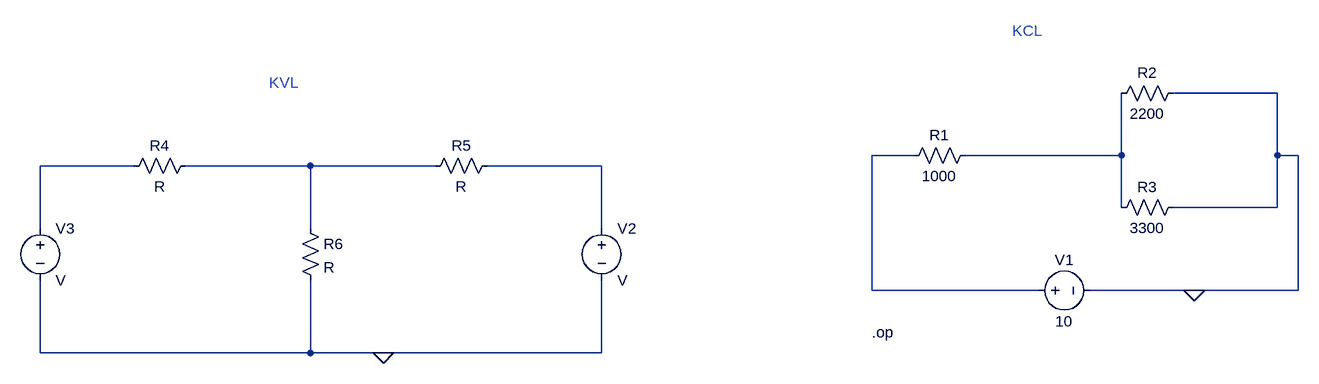
[diagram p0: schematic KCL  and KVL(1).asc]
KCL  and KVL(1).asc, the LTspice schematic file:
Version 4
SHEET 1 880 680
WIRE 624 48 464 48
WIRE 64 144 0 144
WIRE 384 144 384 48
WIRE 384 144 144 144
WIRE 624 144 624 48
WIRE 656 144 624 144
WIRE -1136 160 -1280 160
WIRE -864 160 -1056 160
WIRE -672 160 -864 160
WIRE -416 160 -592 160
WIRE 384 224 384 144
WIRE 624 224 624 144
WIRE 624 224 464 224
WIRE -1280 256 -1280 160
WIRE -864 256 -864 160
WIRE -416 256 -416 160
WIRE 0 352 0 144
WIRE 256 352 0 352
WIRE 496 352 336 352
WIRE 656 352 656 144
WIRE 656 352 496 352
WIRE -1280 448 -1280 336
WIRE -864 448 -864 336
WIRE -864 448 -1280 448
WIRE -752 448 -864 448
WIRE -416 448 -416 336
WIRE -416 448 -752 448
FLAG 496 352 0
FLAG -752 448 0
SYMBOL voltage 240 352 R270
WINDOW 0 32 56 VTop 2
WINDOW 3 -32 56 VBottom 2
SYMATTR InstName V1
SYMATTR Value 10
SYMBOL res 48 160 R270
WINDOW 0 32 56 VTop 2
WINDOW 3 0 56 VBottom 2
SYMATTR InstName R1
SYMATTR Value 1000
SYMBOL res 368 64 R270
WINDOW 0 32 56 VTop 2
WINDOW 3 0 56 VBottom 2
SYMATTR InstName R2
SYMATTR Value 2200
SYMBOL res 368 240 R270
WINDOW 0 32 56 VTop 2
WINDOW 3 0 56 VBottom 2
SYMATTR InstName R3
SYMATTR Value 3300
SYMBOL res -1040 144 R90
WINDOW 0 0 56 VBottom 2
WINDOW 3 32 56 VTop 2
SYMATTR InstName R4
SYMBOL res -576 144 R90
WINDOW 0 0 56 VBottom 2
WINDOW 3 32 56 VTop 2
SYMATTR InstName R5
SYMBOL res -880 240 R0
SYMATTR InstName R6
SYMBOL voltage -416 240 R0
SYMATTR InstName V2
SYMBOL voltage -1280 240 R0
SYMATTR InstName V3
TEXT 0 416 Left 2 !.op
TEXT 216 -48 Left 2 ;KCL
TEXT -928 32 Left 2 ;KVL

The netlist it stands for:
* KCL  and KVL(1).asc
V1 N001 0 10
R1 N001 N002 1000
R2 N002 0 2200
R3 N002 0 3300
R4 N004 N003 R
R5 N005 N004 R
R6 N004 0 R
V2 N005 0 V
V3 N003 0 V
.op
* KCL
* KVL
.backanno
.end